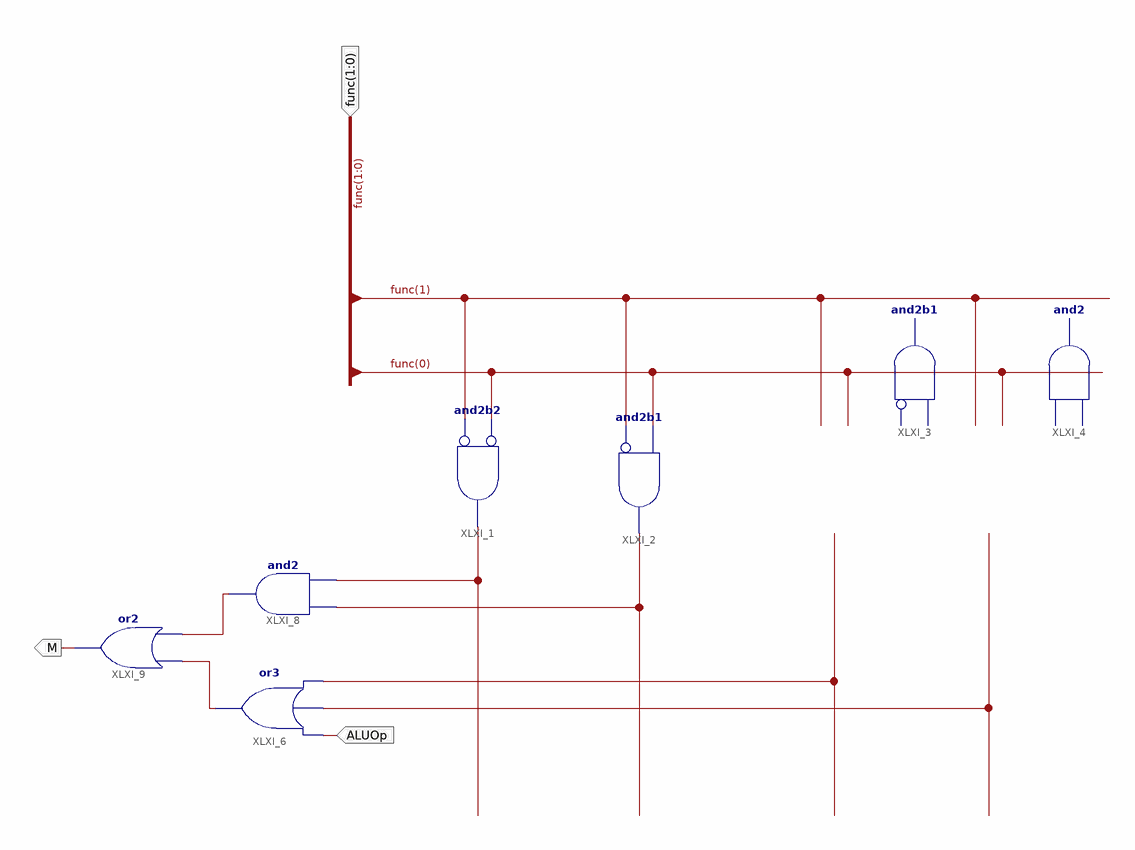
[diagram p0: schematic sheet 1]
// Xilinx ISE schematic ALU_decoder.sch (spartan3e) as structural Verilog: 7 symbols, 3 ports
module ALU_decoder (
  input  [1:0] func,
  input  ALUOp,
  output M
);

  wire XLXN_4, XLXN_5, XLXN_6, XLXN_7, XLXN_11, XLXN_12;

  and XLXI_1 (XLXN_4, ~func[1], ~func[0]);  // and2b2
  and XLXI_2 (XLXN_5, ~func[1], func[0]);  // and2b1
  and XLXI_3 (XLXN_6, ~func[0], func[1]);  // and2b1
  and XLXI_4 (XLXN_7, func[0], func[1]);
  or XLXI_6 (XLXN_12, ALUOp, XLXN_7, XLXN_6);
  and XLXI_8 (XLXN_11, XLXN_5, XLXN_4);
  or XLXI_9 (M, XLXN_12, XLXN_11);
endmodule
